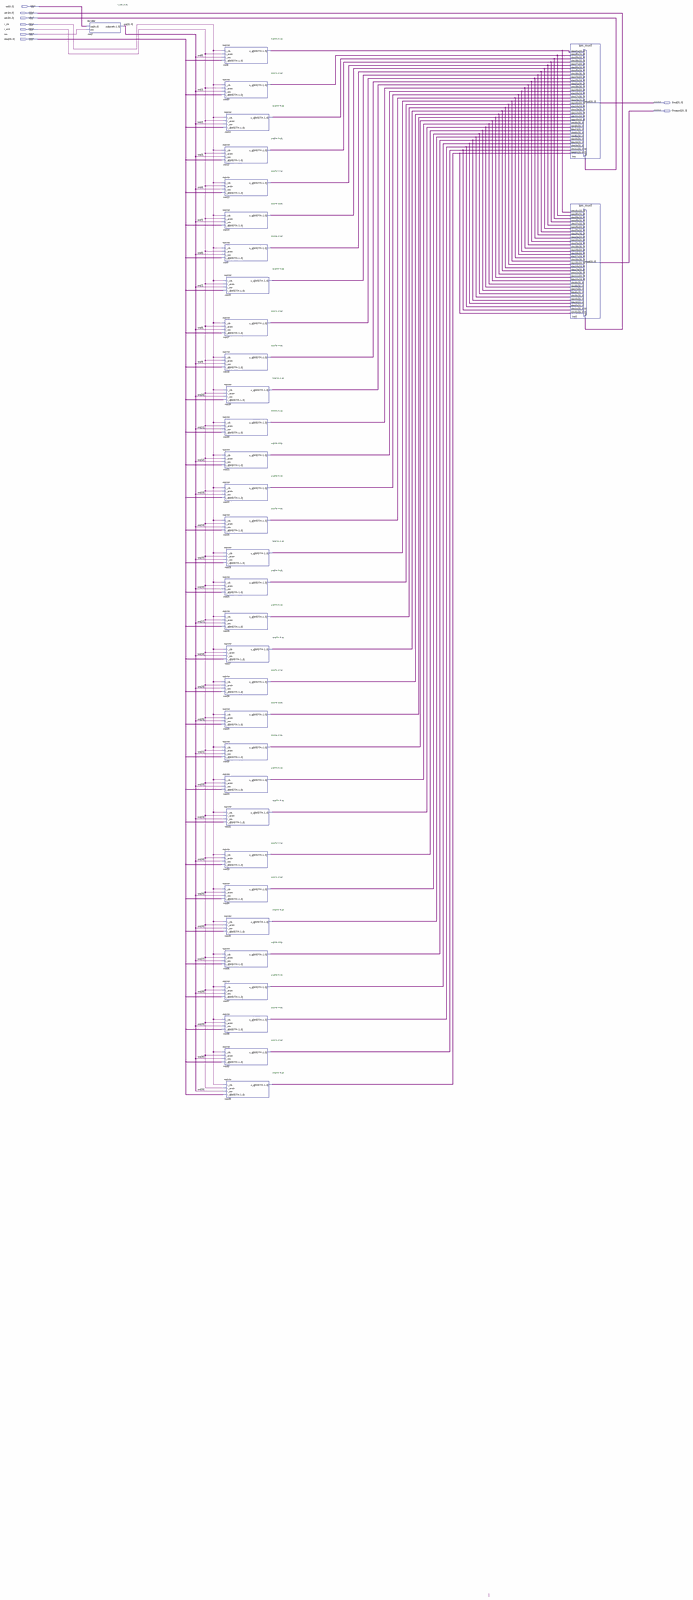
[diagram p0: schematic sheet, whole]
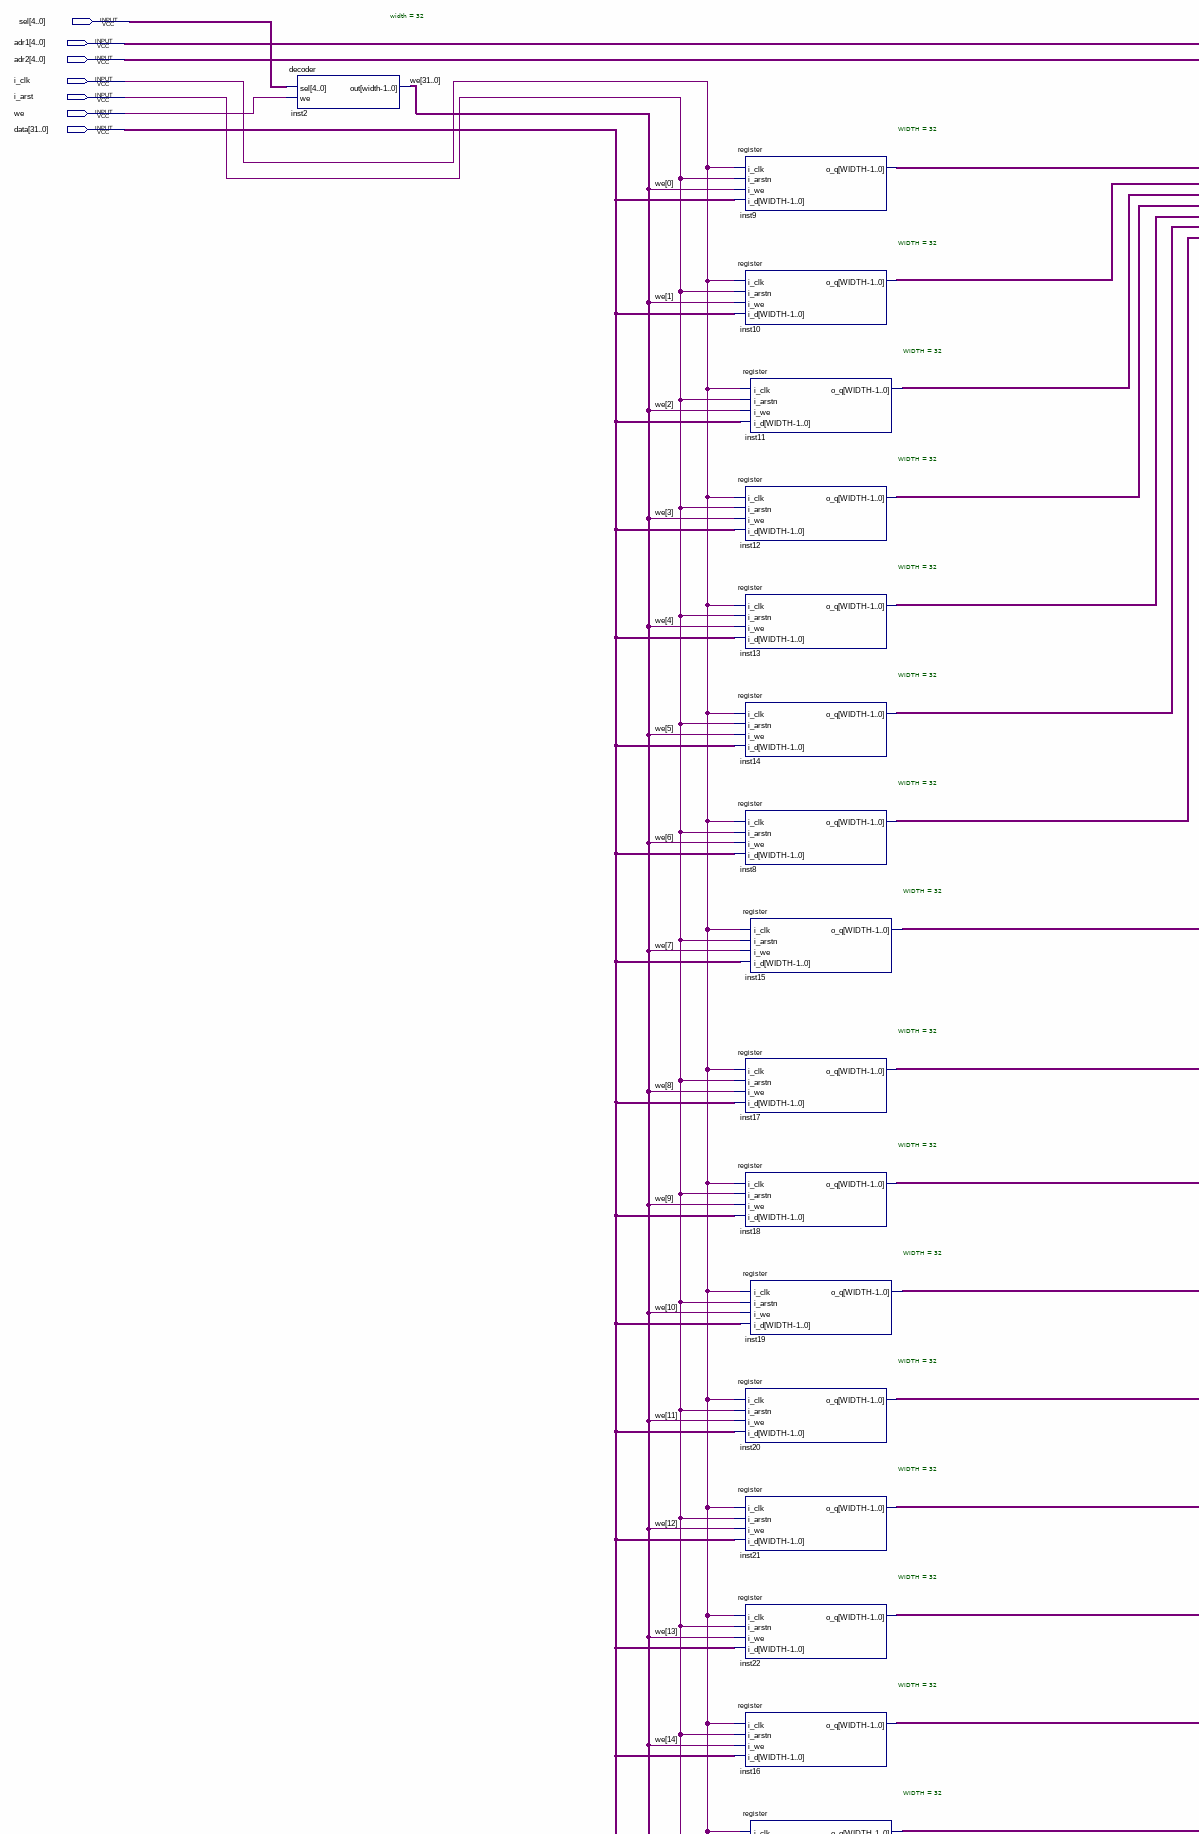
[diagram p1: schematic sheet, upper left part]
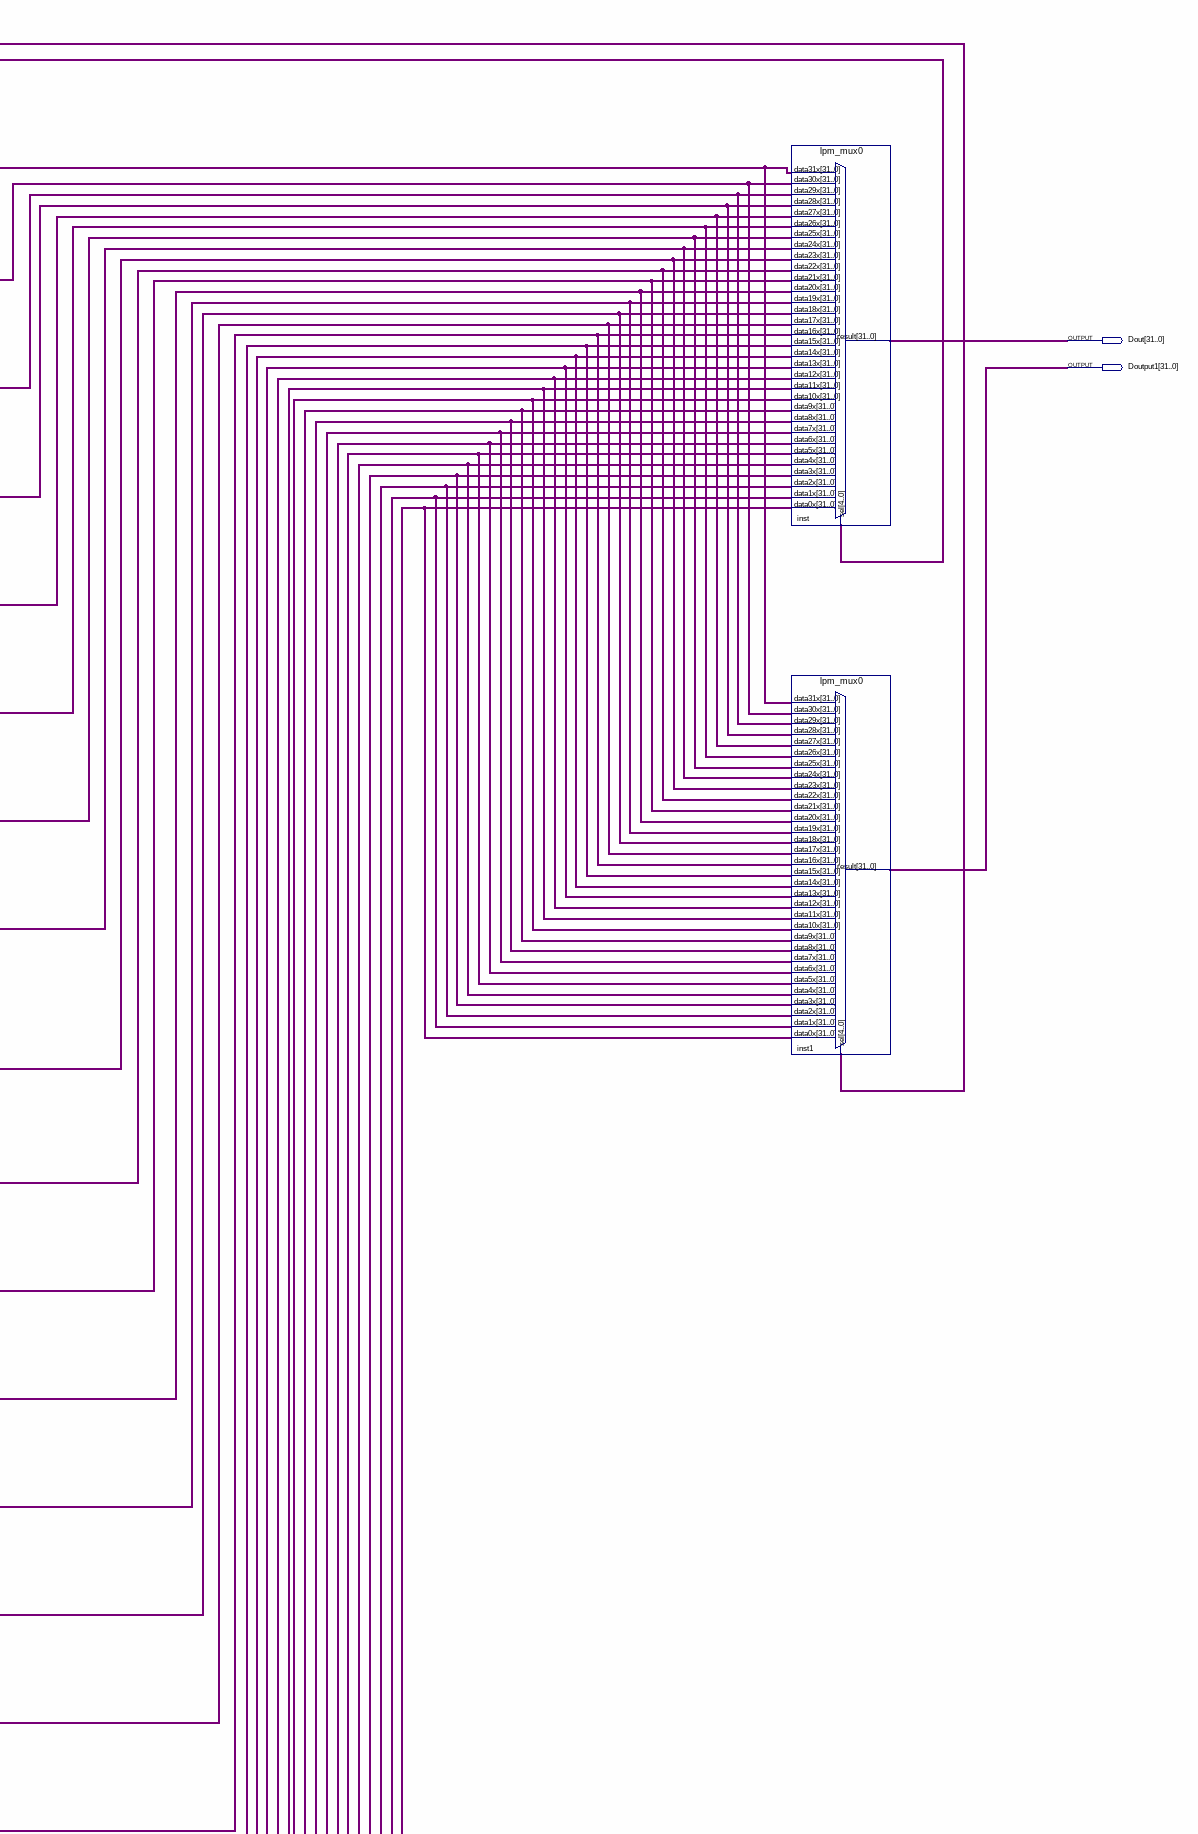
[diagram p2: schematic sheet, upper right part]
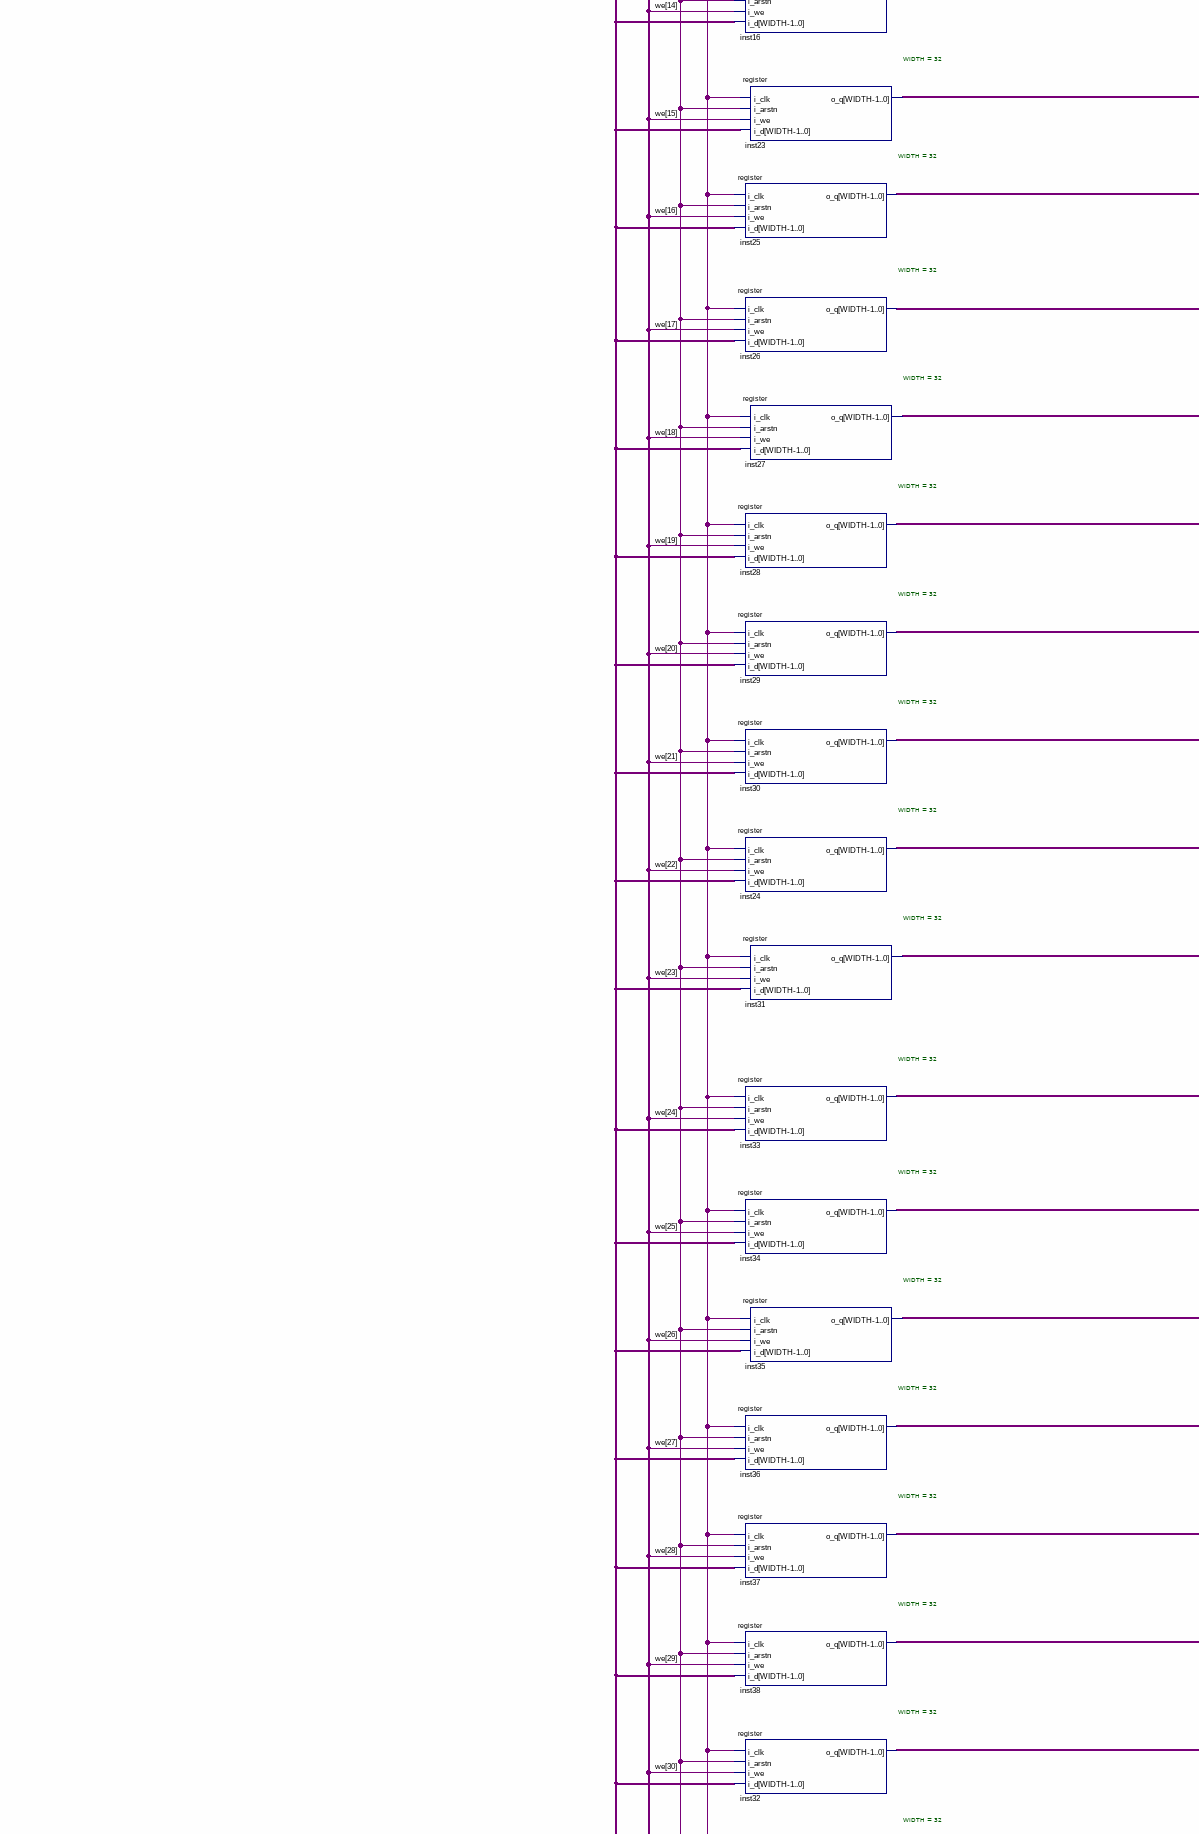
[diagram p3: schematic sheet, middle left part]
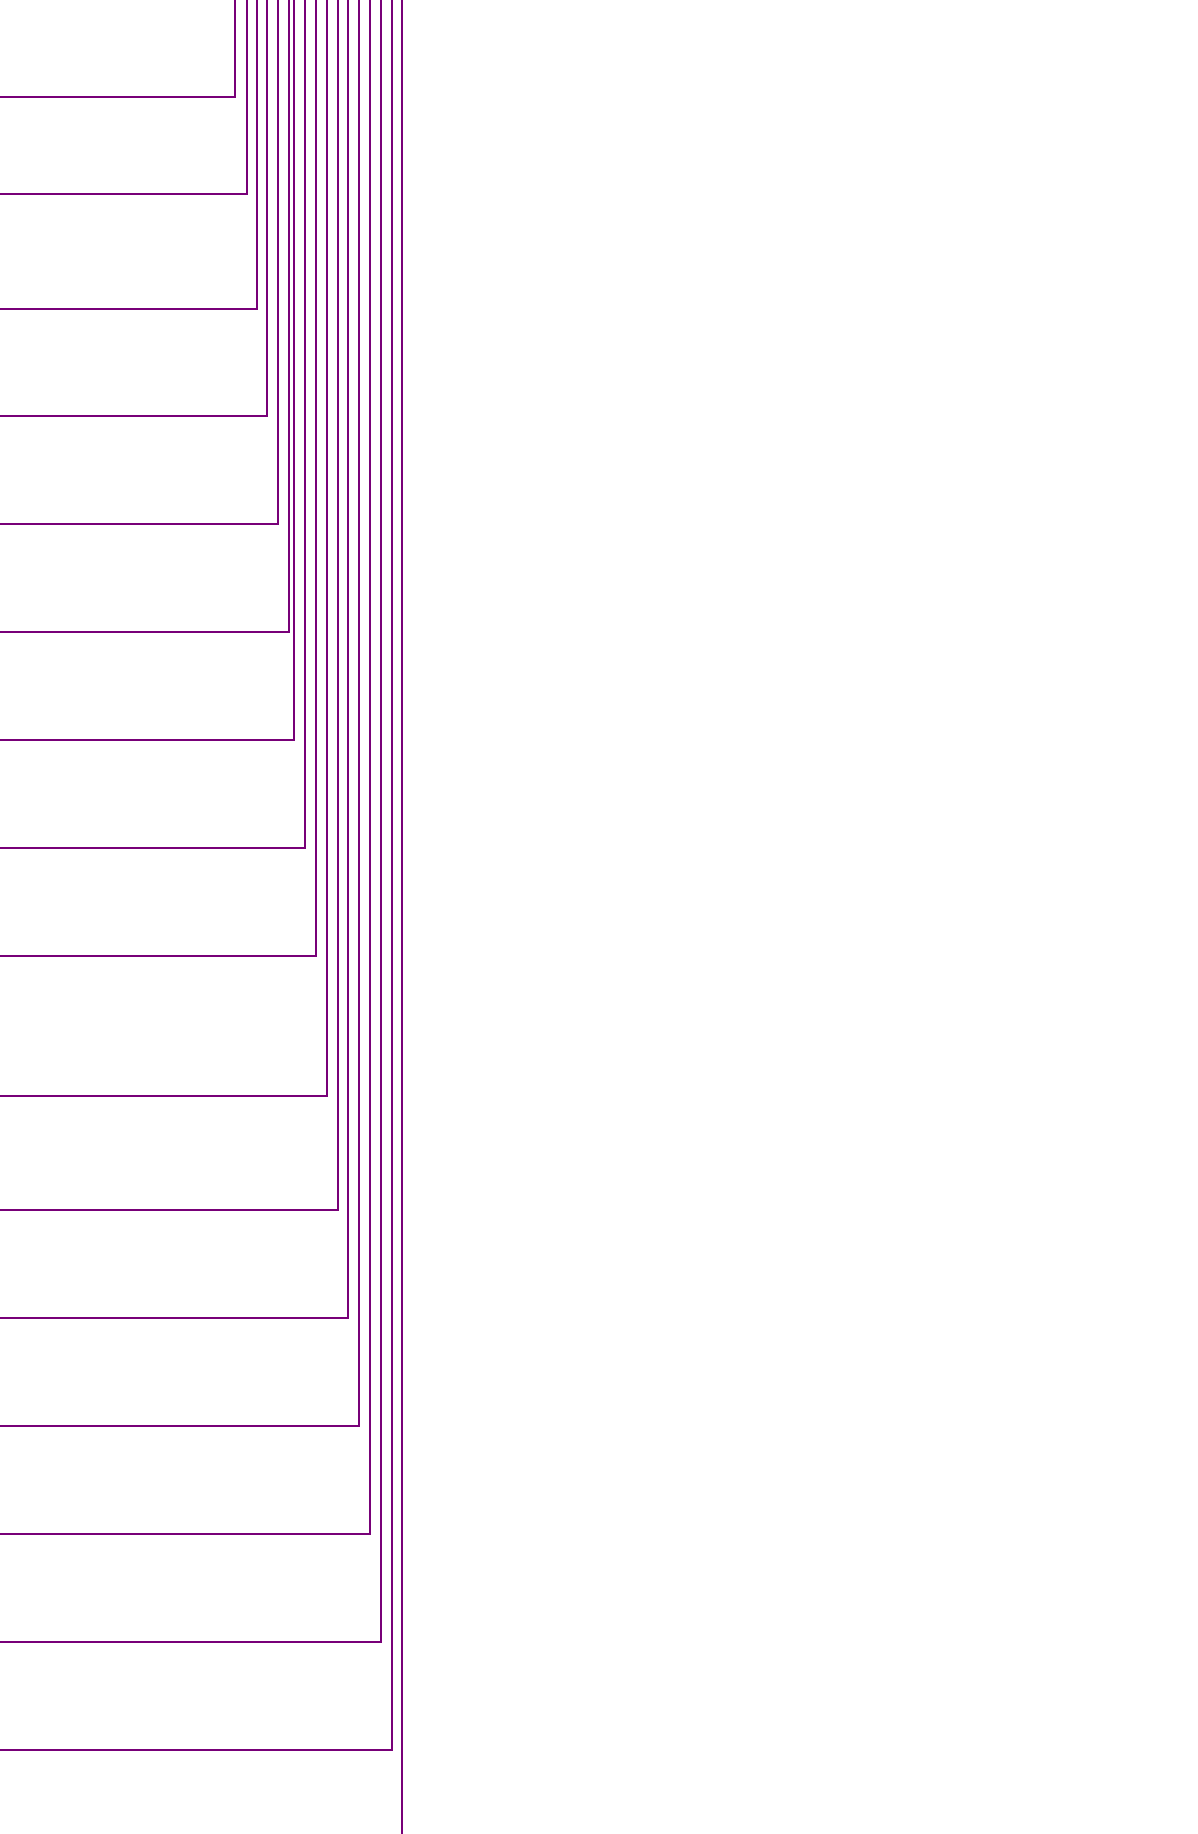
[diagram p4: schematic sheet, middle right part]
// Quartus schematic Block2.bdf as structural Verilog: 35 symbols, 9 pins
module Block2 (
  input  [4:0] sel,
  input  [4:0] adr1,
  input  [4:0] adr2,
  input  i_clk,
  input  i_arst,
  input  we,
  input  [31:0] data,
  output [31:0] Dout,
  output [31:0] Doutput1
);

  wire [31:0] inst8_o_q, inst9_o_q, inst10_o_q, inst11_o_q, inst12_o_q, inst13_o_q, inst14_o_q, inst15_o_q,
       inst16_o_q, inst17_o_q, inst18_o_q, inst19_o_q, inst20_o_q, inst21_o_q, inst22_o_q, inst23_o_q,
       inst24_o_q, inst25_o_q, inst26_o_q, inst27_o_q, inst28_o_q, inst29_o_q, inst30_o_q, inst31_o_q,
       inst32_o_q, inst33_o_q, inst34_o_q, inst35_o_q, inst36_o_q, inst37_o_q, inst38_o_q, inst39_o_q, we_bus;

  decoder #(.width(32)) inst2 (.sel(sel), .we(we), .out(we_bus));
  register #(.WIDTH(32)) inst9 (.i_clk(i_clk), .i_arstn(i_arst), .i_we(we_bus[0]), .i_d(data), .o_q(inst9_o_q));
  register #(.WIDTH(32)) inst10 (.i_clk(i_clk), .i_arstn(i_arst), .i_we(we_bus[1]), .i_d(data), .o_q(inst10_o_q));
  register #(.WIDTH(32)) inst11 (.i_clk(i_clk), .i_arstn(i_arst), .i_we(we_bus[2]), .i_d(data), .o_q(inst11_o_q));
  register #(.WIDTH(32)) inst12 (.i_clk(i_clk), .i_arstn(i_arst), .i_we(we_bus[3]), .i_d(data), .o_q(inst12_o_q));
  register #(.WIDTH(32)) inst13 (.i_clk(i_clk), .i_arstn(i_arst), .i_we(we_bus[4]), .i_d(data), .o_q(inst13_o_q));
  register #(.WIDTH(32)) inst14 (.i_clk(i_clk), .i_arstn(i_arst), .i_we(we_bus[5]), .i_d(data), .o_q(inst14_o_q));
  register #(.WIDTH(32)) inst8 (.i_clk(i_clk), .i_arstn(i_arst), .i_we(we_bus[6]), .i_d(data), .o_q(inst8_o_q));
  register #(.WIDTH(32)) inst15 (.i_clk(i_clk), .i_arstn(i_arst), .i_we(we_bus[7]), .i_d(data), .o_q(inst15_o_q));
  register #(.WIDTH(32)) inst17 (.i_clk(i_clk), .i_arstn(i_arst), .i_we(we_bus[8]), .i_d(data), .o_q(inst17_o_q));
  register #(.WIDTH(32)) inst18 (.i_clk(i_clk), .i_arstn(i_arst), .i_we(we_bus[9]), .i_d(data), .o_q(inst18_o_q));
  register #(.WIDTH(32)) inst19 (.i_clk(i_clk), .i_arstn(i_arst), .i_we(we_bus[10]), .i_d(data), .o_q(inst19_o_q));
  register #(.WIDTH(32)) inst20 (.i_clk(i_clk), .i_arstn(i_arst), .i_we(we_bus[11]), .i_d(data), .o_q(inst20_o_q));
  register #(.WIDTH(32)) inst21 (.i_clk(i_clk), .i_arstn(i_arst), .i_we(we_bus[12]), .i_d(data), .o_q(inst21_o_q));
  register #(.WIDTH(32)) inst22 (.i_clk(i_clk), .i_arstn(i_arst), .i_we(we_bus[13]), .i_d(data), .o_q(inst22_o_q));
  register #(.WIDTH(32)) inst16 (.i_clk(i_clk), .i_arstn(i_arst), .i_we(we_bus[14]), .i_d(data), .o_q(inst16_o_q));
  register #(.WIDTH(32)) inst23 (.i_clk(i_clk), .i_arstn(i_arst), .i_we(we_bus[15]), .i_d(data), .o_q(inst23_o_q));
  register #(.WIDTH(32)) inst25 (.i_clk(i_clk), .i_arstn(i_arst), .i_we(we_bus[16]), .i_d(data), .o_q(inst25_o_q));
  register #(.WIDTH(32)) inst26 (.i_clk(i_clk), .i_arstn(i_arst), .i_we(we_bus[17]), .i_d(data), .o_q(inst26_o_q));
  register #(.WIDTH(32)) inst27 (.i_clk(i_clk), .i_arstn(i_arst), .i_we(we_bus[18]), .i_d(data), .o_q(inst27_o_q));
  register #(.WIDTH(32)) inst28 (.i_clk(i_clk), .i_arstn(i_arst), .i_we(we_bus[19]), .i_d(data), .o_q(inst28_o_q));
  register #(.WIDTH(32)) inst29 (.i_clk(i_clk), .i_arstn(i_arst), .i_we(we_bus[20]), .i_d(data), .o_q(inst29_o_q));
  register #(.WIDTH(32)) inst30 (.i_clk(i_clk), .i_arstn(i_arst), .i_we(we_bus[21]), .i_d(data), .o_q(inst30_o_q));
  register #(.WIDTH(32)) inst24 (.i_clk(i_clk), .i_arstn(i_arst), .i_we(we_bus[22]), .i_d(data), .o_q(inst24_o_q));
  register #(.WIDTH(32)) inst31 (.i_clk(i_clk), .i_arstn(i_arst), .i_we(we_bus[23]), .i_d(data), .o_q(inst31_o_q));
  register #(.WIDTH(32)) inst33 (.i_clk(i_clk), .i_arstn(i_arst), .i_we(we_bus[24]), .i_d(data), .o_q(inst33_o_q));
  register #(.WIDTH(32)) inst34 (.i_clk(i_clk), .i_arstn(i_arst), .i_we(we_bus[25]), .i_d(data), .o_q(inst34_o_q));
  register #(.WIDTH(32)) inst35 (.i_clk(i_clk), .i_arstn(i_arst), .i_we(we_bus[26]), .i_d(data), .o_q(inst35_o_q));
  register #(.WIDTH(32)) inst36 (.i_clk(i_clk), .i_arstn(i_arst), .i_we(we_bus[27]), .i_d(data), .o_q(inst36_o_q));
  register #(.WIDTH(32)) inst37 (.i_clk(i_clk), .i_arstn(i_arst), .i_we(we_bus[28]), .i_d(data), .o_q(inst37_o_q));
  register #(.WIDTH(32)) inst38 (.i_clk(i_clk), .i_arstn(i_arst), .i_we(we_bus[29]), .i_d(data), .o_q(inst38_o_q));
  register #(.WIDTH(32)) inst32 (.i_clk(i_clk), .i_arstn(i_arst), .i_we(we_bus[30]), .i_d(data), .o_q(inst32_o_q));
  register #(.WIDTH(32)) inst39 (.i_clk(i_clk), .i_arstn(i_arst), .i_we(we_bus[31]), .i_d(data), .o_q(inst39_o_q));
  lpm_mux0 inst (
    .data31x(inst9_o_q), .data30x(inst10_o_q), .data29x(inst11_o_q), .data28x(inst12_o_q),
    .data27x(inst13_o_q), .data26x(inst14_o_q), .data25x(inst8_o_q), .data24x(inst15_o_q),
    .data23x(inst17_o_q), .data22x(inst18_o_q), .data21x(inst19_o_q), .data20x(inst20_o_q),
    .data19x(inst21_o_q), .data18x(inst22_o_q), .data17x(inst16_o_q), .data16x(inst23_o_q),
    .data15x(inst25_o_q), .data14x(inst26_o_q), .data13x(inst27_o_q), .data12x(inst28_o_q),
    .data11x(inst29_o_q), .data10x(inst30_o_q), .data9x(inst24_o_q), .data8x(inst31_o_q),
    .data7x(inst33_o_q), .data6x(inst34_o_q), .data5x(inst35_o_q), .data4x(inst36_o_q), .data3x(inst37_o_q),
    .data2x(inst38_o_q), .data1x(inst32_o_q), .data0x(inst39_o_q), .sel(adr2), .result(Dout));
  lpm_mux0 inst1 (
    .data31x(inst9_o_q), .data30x(inst10_o_q), .data29x(inst11_o_q), .data28x(inst12_o_q),
    .data27x(inst13_o_q), .data26x(inst14_o_q), .data25x(inst8_o_q), .data24x(inst15_o_q),
    .data23x(inst17_o_q), .data22x(inst18_o_q), .data21x(inst19_o_q), .data20x(inst20_o_q),
    .data19x(inst21_o_q), .data18x(inst22_o_q), .data17x(inst16_o_q), .data16x(inst23_o_q),
    .data15x(inst25_o_q), .data14x(inst26_o_q), .data13x(inst27_o_q), .data12x(inst28_o_q),
    .data11x(inst29_o_q), .data10x(inst30_o_q), .data9x(inst24_o_q), .data8x(inst31_o_q),
    .data7x(inst33_o_q), .data6x(inst34_o_q), .data5x(inst35_o_q), .data4x(inst36_o_q), .data3x(inst37_o_q),
    .data2x(inst38_o_q), .data1x(inst32_o_q), .data0x(inst39_o_q), .sel(adr1), .result(Doutput1));
endmodule
